# EasyEDA schematic SCH_OpenApolloV1.json
TITLE: OpenApollo CM5-powered Circuit; REV: 1.0; Date: 2025-07-07; Sheet: 1/1; Company: Your Company
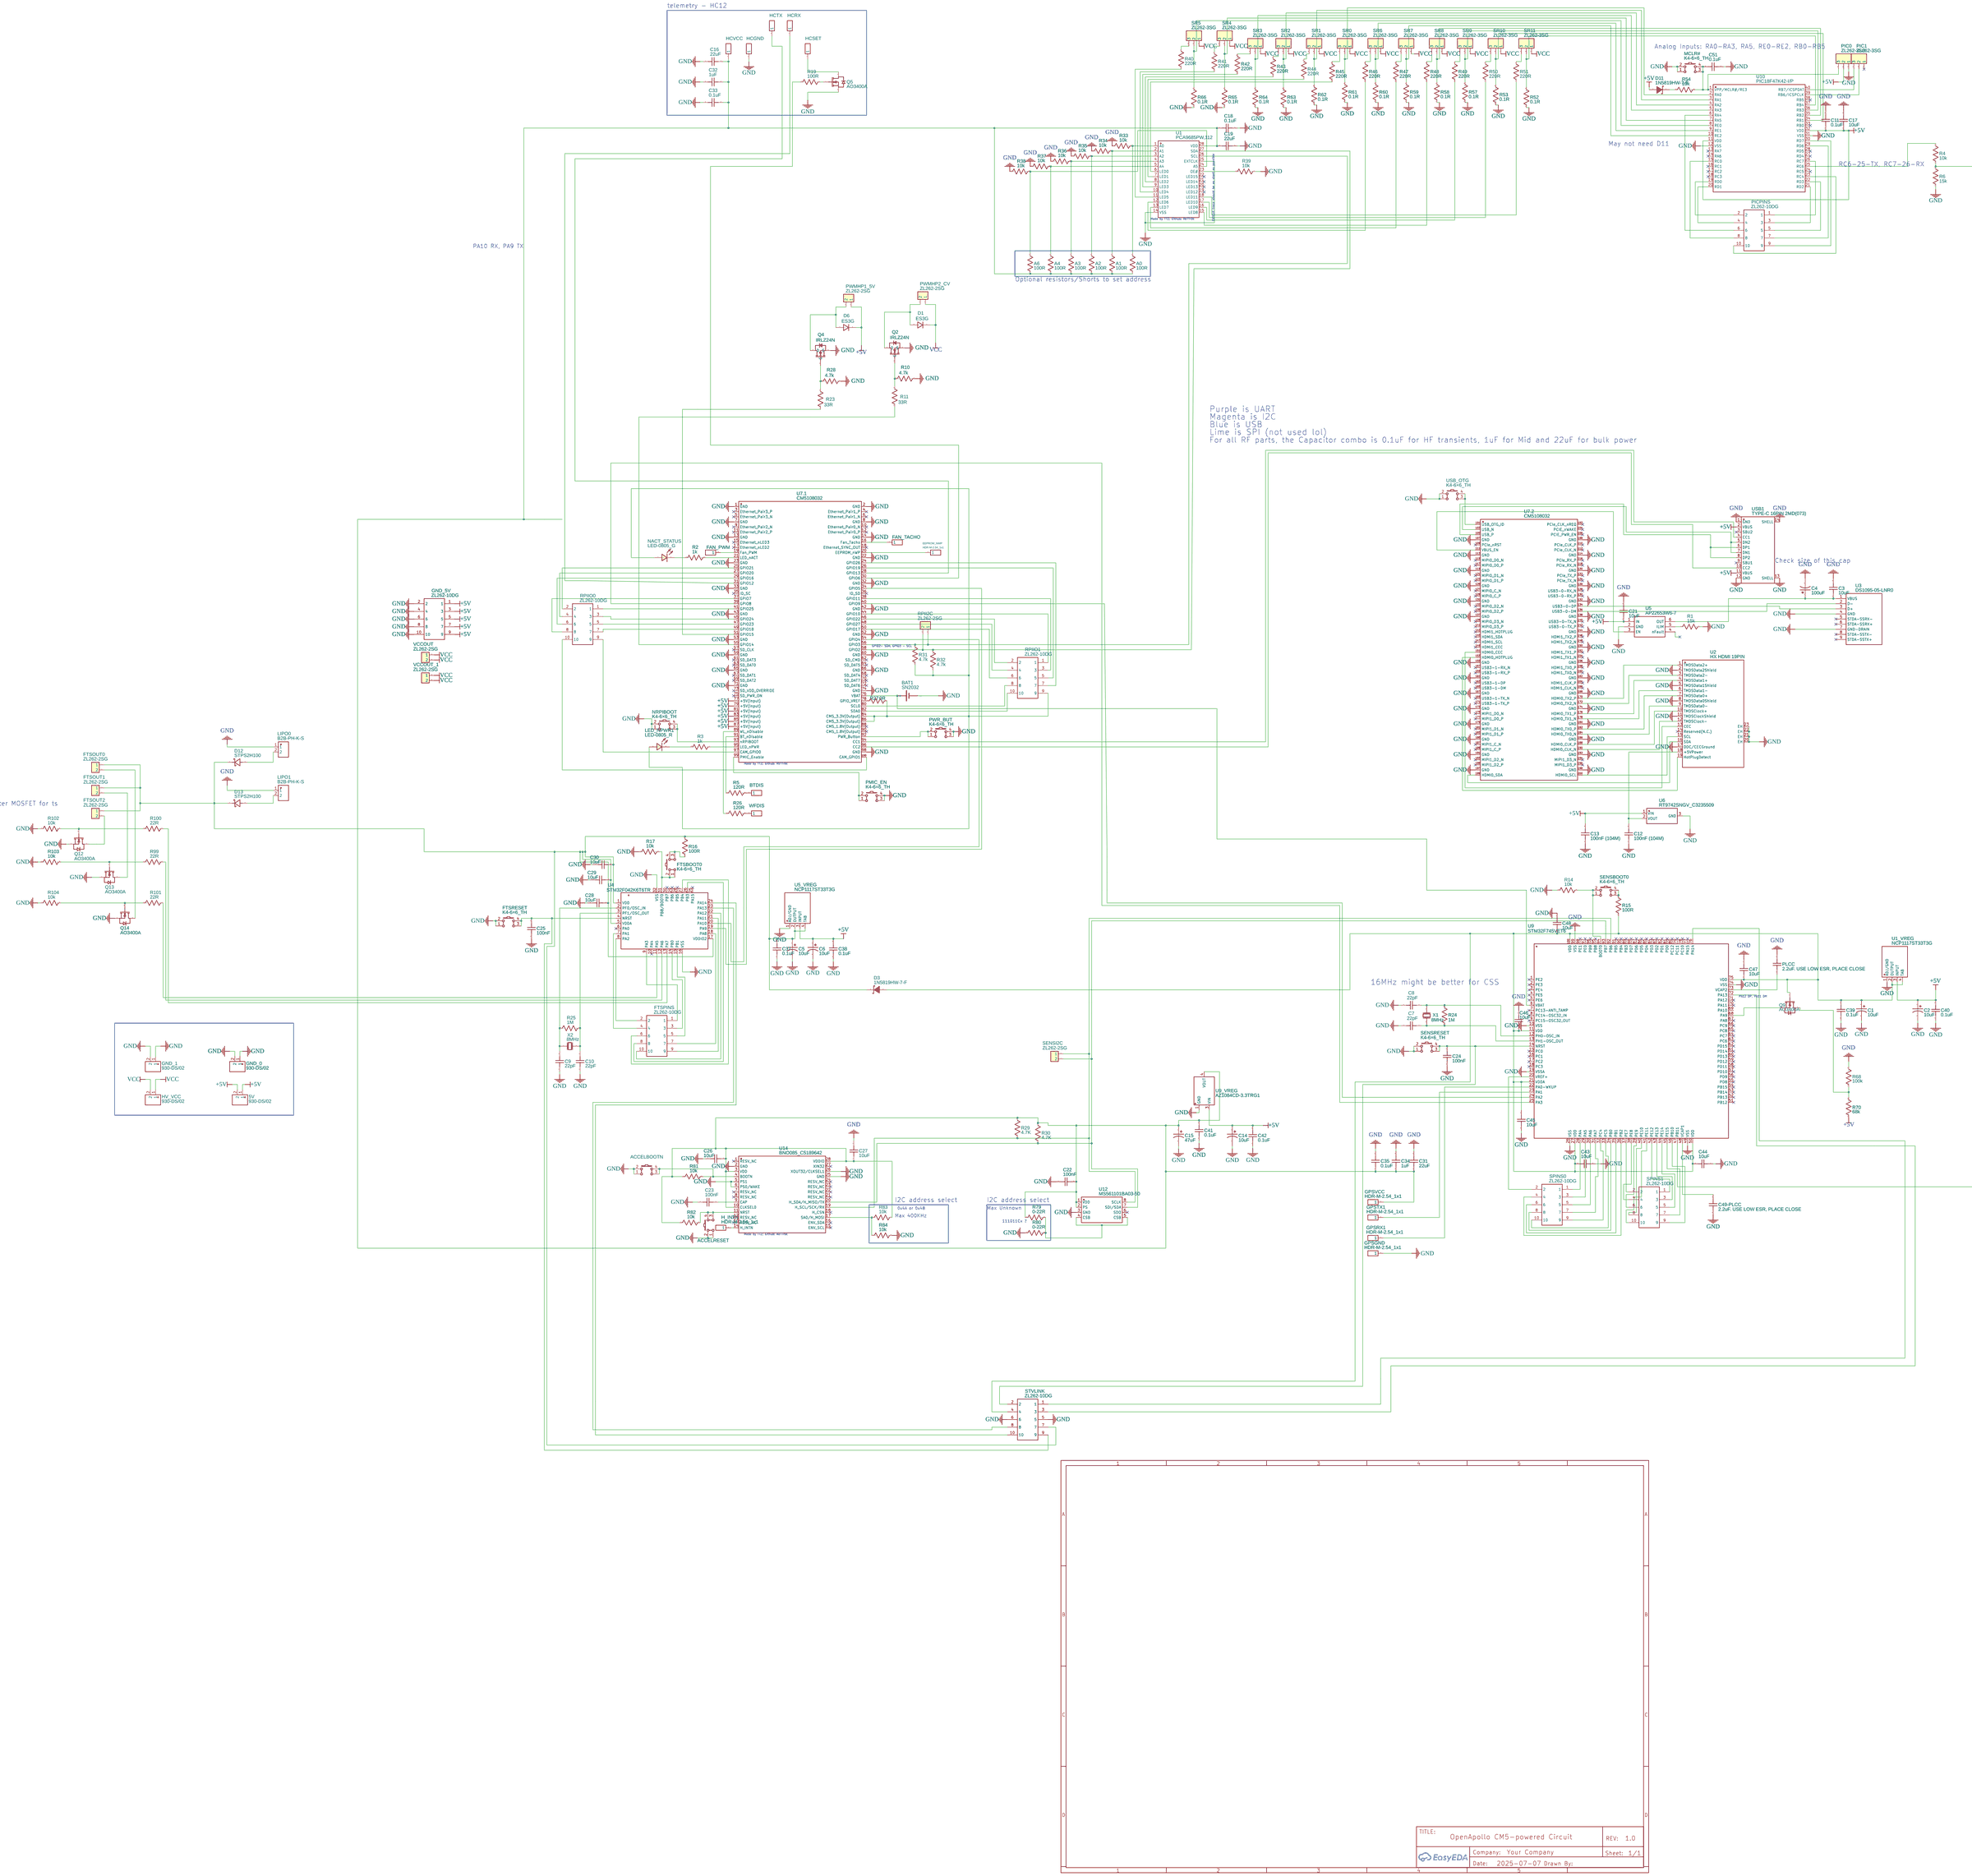
[diagram p0: schematic sheet]

## Parts
5V  930-DS/02  [CONN-TH_2P-P3.50_930-DS-02]
A0  100R  [R0805]
A1  100R  [R0805]
A2  100R  [R0805]
A3  100R  [R0805]
A4  100R  [R0805]
A6  100R  [R0805]
ACCELBOOTN  K4-6×6_TH  [KEY-TH_4P-L6.0-W6.0-P4.50-LS6.5]
ACCELRESET  K4-6×6_TH  [KEY-TH_4P-L6.0-W6.0-P4.50-LS6.5]
BAT1  SN2032  [SN2032]
BTDIS  HDR-M-2.54_1x1  [HDR-M-2.54_1X1]
C1  10uF  [CAP-D5.0×F2.0]
C2  10uF  [CAP-D5.0×F2.0]
C3  10uF  [C1206]
C4  100uF  [CAP-D6.3×F2.5]
C5  10uF  [CAP-D5.0×F2.0]
C6  10uF  [CAP-D5.0×F2.0]
C7  22pF  [RAD-0.1]
C8  22pF  [RAD-0.1]
C9  22pF  [RAD-0.1]
C10  22pF  [RAD-0.1]
C11  0.1uF  [C1206]
C12  100nF (104M)  [C1206]
C13  100nF (104M)  [C1206]
C14  10uF  [CAP-D5.0×F2.0]
C15  47uF  [CAP-D4.0×F1.5]
C16  22uF  [C1206]
C17  10uF  [C1206]
C18  0.1uF  [C1206]
C19  22uF  [C1206]
C21  10uF  [C1206]
C22  100nF  [C1206]
C23  100nF  [C1206]
C24  100nF  [C1206]
C25  100nF  [C1206]
C26  10uF  [C1206]
C27  10uF  [C1206]
C28  10uF  [C1206]
C29  10uF  [C1206]
C30  10uF  [C1206]
C31  22uF  [C1206]
C32  1uF  [C1206]
C33  0.1uF  [C1206]
C34  1uF  [C1206]
C35  0.1uF  [C1206]
C37  0.1uF  [C1206]
C38  0.1uF  [C1206]
C39  0.1uF  [C1206]
C40  0.1uF  [C1206]
C41  0.1uF  [C1206]
C42  0.1uF  [C1206]
C43  10uF  [C1206]
C44  10uF  [C1206]
C45  10uF  [C1206]
C46  10uF  [C1206]
C47  10uF  [C1206]
C48  10uF  [C1206]
C49-PLCC  2.2uF. USE LOW ESR, PLACE CLOSE  [C1206]
C51  0.1uF  [C1206]
D1  ES3G  [SMC_L7.1-W6.2-LS8.1-RD]
D3  1N5819HW-7-F  [SOD-123_L2.7-W1.6-LS3.7-RD]
D6  ES3G  [SMC_L7.1-W6.2-LS8.1-RD]
D11  1N5819HW-7-F  [SOD-123_L2.7-W1.6-LS3.7-RD]
D12  STPS2H100  [DO-41_BD2.4-L4.7-P8.70-D0.9-RD]
D13  STPS2H100  [DO-41_BD2.4-L4.7-P8.70-D0.9-RD]
EEPROM_NWP  HDR-M-2.54_1x1  [HDR-M-2.54_1X1]
FAN_PWM  HDR-M-2.54_1x1  [HDR-M-2.54_1X1]
FAN_TACHO  HDR-M-2.54_1x1  [HDR-M-2.54_1X1]
FTSBOOT0  K4-6×6_TH  [KEY-TH_4P-L6.0-W6.0-P4.50-LS6.5]
FTSOUT0  ZL262-2SG  [HEADER 1X2 FEMALE AG4]
FTSOUT1  ZL262-2SG  [HEADER 1X2 FEMALE AG4]
FTSOUT2  ZL262-2SG  [HEADER 1X2 FEMALE AG4]
FTSPINS  ZL262-10DG  [ZL262-10DG]
FTSRESET  K4-6×6_TH  [KEY-TH_4P-L6.0-W6.0-P4.50-LS6.5]
GND_0  930-DS/02  [CONN-TH_2P-P3.50_930-DS-02]
GND_1  930-DS/02  [CONN-TH_2P-P3.50_930-DS-02]
GND_5V  ZL262-10DG  [ZL262-10DG]
GPSGND  HDR-M-2.54_1x1  [HDR-M-2.54_1X1]
GPSRX1  HDR-M-2.54_1x1  [HDR-M-2.54_1X1]
GPSTX1  HDR-M-2.54_1x1  [HDR-M-2.54_1X1]
GPSVCC  HDR-M-2.54_1x1  [HDR-M-2.54_1X1]
H_INTN  HDR-M-2.54_1x1  [HDR-M-2.54_1X1]
HCGND  HDR-M-2.54_1x1  [HDR-M-2.54_1X1]
HCRX  HDR-M-2.54_1x1  [HDR-M-2.54_1X1]
HCSET  HDR-M-2.54_1x1  [HDR-M-2.54_1X1]
HCTX  HDR-M-2.54_1x1  [HDR-M-2.54_1X1]
HCVCC  HDR-M-2.54_1x1  [HDR-M-2.54_1X1]
HV_VCC  930-DS/02  [CONN-TH_2P-P3.50_930-DS-02]
LED_NPWR1  LED-0805_R  [LED0805_RED]
LIPO0  B2B-PH-K-S  [CONN-TH_B2B-PH-K-S]
LIPO1  B2B-PH-K-S  [CONN-TH_B2B-PH-K-S]
MCLR#  K4-6×6_TH  [KEY-TH_4P-L6.0-W6.0-P4.50-LS6.5]
NACT_STATUS  LED-0805_G  [LED0805_GREEN]
NRPIBOOT  K4-6×6_TH  [KEY-TH_4P-L6.0-W6.0-P4.50-LS6.5]
PIC0  ZL262-3SG  [HDR-F-2.54_1X3]
PIC1  ZL262-3SG  [HDR-F-2.54_1X3]
PICPINS  ZL262-10DG  [ZL262-10DG]
PLCC  2.2uF. USE LOW ESR, PLACE CLOSE  [C1206]
PMIC_EN  K4-6×6_TH  [KEY-TH_4P-L6.0-W6.0-P4.50-LS6.5]
PWMHP1_5V  ZL262-2SG  [HEADER 1X2 FEMALE AG4]
PWMHP2_CV  ZL262-2SG  [HEADER 1X2 FEMALE AG4]
PWR_BUT  K4-6×6_TH  [KEY-TH_4P-L6.0-W6.0-P4.50-LS6.5]
Q2  IRLZ24N  [IRLZ24N]
Q4  IRLZ24N  [IRLZ24N]
Q5  AO3400A  [SOT-23-3_L2.9-W1.3-P1.90-LS2.4-BR]
Q9  AO3400A  [SOT-23-3_L2.9-W1.3-P1.90-LS2.4-BR]
Q12  AO3400A  [SOT-23-3_L2.9-W1.3-P1.90-LS2.4-BR]
Q13  AO3400A  [SOT-23-3_L2.9-W1.3-P1.90-LS2.4-BR]
Q14  AO3400A  [SOT-23-3_L2.9-W1.3-P1.90-LS2.4-BR]
R1  15k  [R0805]
R2  1k  [R1206]
R3  1k  [R1206]
R4  10k  [R0805]
R5  120R  [R0805]
R6  15k  [R0805]
R10  4.7k  [R1206]
R11  33R  [R1206]
R14  10k  [R0805]
R15  100R  [R0805]
R16  100R  [R0805]
R17  10k  [R0805]
R19  100R  [R0805]
R23  33R  [R1206]
R24  1M  [R1206]
R25  1M  [R1206]
R26  120R  [R0805]
R27  0R  [R1206]
R28  4.7k  [R1206]
R29  4.7K  [R1206]
R30  4.7K  [R1206]
R31  4.7k  [R1206]
R32  4.7k  [R1206]
R33  10k  [R0805]
R34  10k  [R0805]
R35  10k  [R0805]
R36  10k  [R0805]
R37  10k  [R0805]
R38  10k  [R0805]
R39  10k  [R0805]
R40  220R  [R0805]
R41  220R  [R0805]
R42  220R  [R0805]
R43  220R  [R0805]
R44  220R  [R0805]
R45  220R  [R0805]
R46  220R  [R0805]
R47  220R  [R0805]
R48  220R  [R0805]
R49  220R  [R0805]
R50  220R  [R0805]
R51  220R  [R0805]
R52  0.1R  [R_AXIAL-0.8]
R53  0.1R  [R_AXIAL-0.8]
R54  10k  [R1206]
R57  0.1R  [R_AXIAL-0.8]
R58  0.1R  [R_AXIAL-0.8]
R59  0.1R  [R_AXIAL-0.8]
R60  0.1R  [R_AXIAL-0.8]
R61  0.1R  [R_AXIAL-0.8]
R62  0.1R  [R_AXIAL-0.8]
R63  0.1R  [R_AXIAL-0.8]
R64  0.1R  [R_AXIAL-0.8]
R65  0.1R  [R_AXIAL-0.8]
R66  0.1R  [R_AXIAL-0.8]
R68  100k  [R0805]
R70  68k  [R0805]
R79  0-22R  [R1206]
R80  0-22R  [R1206]
R81  10k  [R0805]
R82  10k  [R0805]
R83  10k  [R0805]
R84  10k  [R0805]
R99  22R  [R0805]
R100  22R  [R0805]
R101  22R  [R0805]
R102  10k  [R0805]
R103  10k  [R0805]
R104  10k  [R0805]
RPII2C  ZL262-2SG  [HEADER 1X2 FEMALE AG4]
RPIIO0  ZL262-10DG  [ZL262-10DG]
RPIIO1  ZL262-10DG  [ZL262-10DG]
SENSBOOT0  K4-6×6_TH  [KEY-TH_4P-L6.0-W6.0-P4.50-LS6.5]
SENSI2C  ZL262-2SG  [HEADER 1X2 FEMALE AG4]
SENSRESET  K4-6×6_TH  [KEY-TH_4P-L6.0-W6.0-P4.50-LS6.5]
SPINS0  ZL262-10DG  [ZL262-10DG]
SPINS1  ZL262-10DG  [ZL262-10DG]
SR0  ZL262-3SG  [HDR-F-2.54_1X3]
SR1  ZL262-3SG  [HDR-F-2.54_1X3]
SR2  ZL262-3SG  [HDR-F-2.54_1X3]
SR3  ZL262-3SG  [HDR-F-2.54_1X3]
SR4  ZL262-3SG  [HDR-F-2.54_1X3]
SR5  ZL262-3SG  [HDR-F-2.54_1X3]
SR6  ZL262-3SG  [HDR-F-2.54_1X3]
SR7  ZL262-3SG  [HDR-F-2.54_1X3]
SR8  ZL262-3SG  [HDR-F-2.54_1X3]
SR9  ZL262-3SG  [HDR-F-2.54_1X3]
SR10  ZL262-3SG  [HDR-F-2.54_1X3]
SR11  ZL262-3SG  [HDR-F-2.54_1X3]
STVLINK  ZL262-10DG  [ZL262-10DG]
U1  PCA9685PW,112  [TSSOP-28_L9.7-W4.4-P0.65-LS6.4-BL]
U1_VREG  NCP1117ST33T3G  [SOT-223-3_L6.5-W3.4-P2.30-LS7.0-BR]
U2  HX HDMI 19PIN  [HDMI-SMD_HX-HDMI-19PIN]
U3  DS1095-05-LNR0  [DS1095-05-LNR0]
U4  STM32F042K6T6TR  [LQFP-32_L7.0-W7.0-P0.80-LS9.0-BL]
U5  AP22653W6-7  [AP22653W6-7]
U5_VREG  NCP1117ST33T3G  [SOT-223-3_L6.5-W3.4-P2.30-LS7.0-BR]
U6  RT9742SNGV_C3235509  [SOT-23-3_L2.9-W1.6-P1.90-LS2.8-BR]
U7  CM5108032  [COMM-SMD_L55.0-W40.0_CM5]  (sections 1,2)
U9  STM32F745VET6  [LQFP-100_L14.0-W14.0-P0.50-LS16.0-BL]
U9_VREG  AZ1084CD-3.3TRG1  [TO-252-2_L6.5-W6.1-P4.58-LS10.0-TL]
U10  PIC18F47K42-I/P  [PDIP-40_L52.3-W13.8-P2.54-LS15.2-BL]
U12  MS561101BA03-50  [SENSORS-SMD_MS5611-01BA03]
U14  BNO085_C5189642  [LGA-28_L5.2-W3.8-P0.50-BL]
USB1  TYPE-C 16PIN 2MD(073)  [USB-C-SMD_TYPE-C-6PIN-2MD-073]
USB_OTG  K4-6×6_TH  [KEY-TH_4P-L6.0-W6.0-P4.50-LS6.5]
VCCOUT  ZL262-2SG  [HEADER 1X2 FEMALE AG4]
VCCOUT_1  ZL262-2SG  [HEADER 1X2 FEMALE AG4]
WFDIS  HDR-M-2.54_1x1  [HDR-M-2.54_1X1]
X1  8MHz  [HC-49S_L11.5-W4.7-P4.88]
X2  8MHz  [HC-49S_L11.5-W4.7-P4.88]

## Library data of the parts
5V GND_0 GND_1 HV_VCC = 930-DS/02: Supplier: LCSC; Supplier Part: C2974856; Manufacturer: WECO(威克德诺); Contributor: lcsc; JLCPCB Part Class: Extended Part
A0-A4 A6 R1 R4-R6 R14-R17 R19 R26 R33-R51 R68 R70 R81-R84 R99-R104 = R_0805_US: Contributor: LCEDA_Lib
ACCELBOOTN ACCELRESET FTSBOOT0 FTSRESET MCLR# NRPIBOOT PMIC_EN PWR_BUT SENSBOOT0 SENSRESET USB_OTG = K4-6×6_TH: Supplier: LCSC; Supplier Part: C136684; Manufacturer: 韩国韩荣; Manufacturer Part: K2-1102DP-E4SW-04; Contributor: LCEDA_Lib
BAT1 = SN2032: Contributor: lontecsac
BTDIS EEPROM_NWP FAN_PWM FAN_TACHO GPSGND GPSRX1 GPSTX1 GPSVCC H_INTN HCGND HCRX HCSET HCTX HCVCC WFDIS = HDR-M-2.54_1x1: Supplier Part: C81276; Supplier: LCSC; Contributor: LCEDA_Lib
C1 C2 C5 C6 C14 = CE_TH_D5.0×F2.0_US: Contributor: LCEDA_Lib
C3 C11-C13 C16-C19 C21-C35 C37-C48 C49-PLCC C51 PLCC = C_1206_US: Contributor: LCEDA_Lib
C4 = CE_TH_D6.3×F2.5_US: Contributor: LCEDA_Lib
C7-C10 = C_RAD-0.1_US: Contributor: LCEDA_Lib
C15 = CE_TH_D4.0×F1.5_US: Contributor: LCEDA_Lib
D1 D6 = ES3G-C: Contributor: AVR_NEL; Supplier Part: C163764; Supplier: LCSC; Manufacturer: FMS(美丽微); JLCPCB Part Class: Extended Part
D3 D11 = 1N5819HW-7-F: Supplier: LCSC; Manufacturer: DIODES(美台); Supplier Part: C82544; JLCPCB Part Class: Extended Part
D12 D13 = STPS2H100: Supplier: LCSC; Supplier Part: C2970310; Manufacturer: ST(意法半导体); JLCPCB Part Class: Extended Part; Contributor: lcsc
FTSOUT0-FTSOUT2 PWMHP1_5V PWMHP2_CV RPII2C SENSI2C VCCOUT VCCOUT_1 = ZL262-2SG: Contributor: AndrzejGeciow
FTSPINS GND_5V PICPINS RPIIO0 RPIIO1 SPINS0 SPINS1 STVLINK = ZL262-10DG: Contributor: marton_m
LED_NPWR1 = LED-0805_R: Manufacturer: EVERLIGHT(台湾亿光); Manufacturer Part: 17-21SURC/S530-A3/TR8; Supplier Part: C72037; Contributor: LCEDA_Lib
LIPO0 LIPO1 = B2B-PH-K-S: Supplier: LCSC; Supplier Part: C20504437; Manufacturer: JST; JLCPCB Part Class: Extended Part; Contributor: lcsc
NACT_STATUS = LED-0805_G: Manufacturer: 国星光电; Manufacturer Part: NCD0805G1; Supplier Part: C84260; Contributor: LCEDA_Lib
PIC0 PIC1 SR0-SR11 = ZL262-3SG: Manufacturer: CONNFLY; Supplier Part: 00-00040667; Supplier: Kosmodrom; link: http://www.kosmodrom.com.ua/prodlist.php?page=0&name=00-00040667&okbutton=Search; Contributor: AndrzejGeciow
Q2 Q4 = IRLZ24N: Supplier: LCSC; Manufacturer: IR; Manufacturer Part: IRLZ24n; Supplier Part: C11728; JLCPCB Part Class: Extended Part; Contributor: RuiMendes
Q5 Q9 Q12-Q14 = AO3400A: Supplier: LCSC; Manufacturer: AOS; Supplier Part: C20917; JLCPCB Part Class: Basic Part
R2 R3 R10 R11 R23-R25 R27-R32 R54 R79 R80 = R_1206_US: Contributor: LCEDA_Lib
R52 R53 R57-R66 = R_AXIAL-0.8_US: Contributor: LCEDA_Lib
U1 = PCA9685PW,112: Contributor: lcsc; Supplier: LCSC; Supplier Part: C2688894; Manufacturer: NXP(恩智浦); JLCPCB Part Class: Extended Part
U1_VREG U5_VREG = NCP1117ST33T3G: Supplier: LCSC; Manufacturer: onsemi(安森美); Supplier Part: C26537; JLCPCB Part Class: Extended Part
U2 = HX HDMI 19PIN: Contributor: lcsc; Supplier: LCSC; Supplier Part: C5184845; Manufacturer: hanxia(韩下); JLCPCB Part Class: Extended Part
U3 = DS1095-05-LNR0: Manufacturer: Connfly electronic (Zhenqin); Manufacturer Part: DS1095-05LNR0; Contributor: zyk83zyk
U4 = STM32F042K6T6TR: Contributor: LCSC; Supplier: LCSC; Supplier Part: C529323; Manufacturer: ST(意法半导体); JLCPCB Part Class: Extended Part
U5 = AP22653W6-7: Manufacturer: DIODES INC; Supplier Part: 31-AP22653W6-7TR-ND; Supplier: Digi-Key; link: https://www.diodes.com/assets/Datasheets/AP22652_53_52A_53A.pdf; Contributor: robertr2
U6 = RT9742SNGV_C3235509: Contributor: lcsc; Supplier: LCSC; Supplier Part: C3235509; Manufacturer: RICHTEK(立锜); Manufacturer Part: RT9742SNGV; JLCPCB Part Class: Extended Part
U7 = CM5108032: Supplier: Mouser; Supplier Part: C42394223; Manufacturer: Raspberry Pi(树莓派); subpart_no: 1
U9 = STM32F745VET6: Supplier: LCSC; Manufacturer: ST(意法半导体); Supplier Part: C87700; JLCPCB Part Class: Extended Part
U9_VREG = AZ1084CD-3.3TRG1: Contributor: LCSC; Supplier: LCSC; Supplier Part: C151391; Manufacturer: DIODES(美台); JLCPCB Part Class: Extended Part
U10 = PIC18F47K42-I/P: Contributor: LCSC; Supplier: LCSC; Supplier Part: C648048; Manufacturer: MICROCHIP(美国微芯); JLCPCB Part Class: Extended Part
U12 = MS561101BA03-50: Contributor: LCSC; Supplier: LCSC; Supplier Part: C15639; Manufacturer: TE Connectivity(泰科电子); JLCPCB Part Class: Extended Part
U14 = BNO085_C5189642: Supplier: LCSC; Supplier Part: C5189642; Manufacturer: CEVA; Manufacturer Part: BNO085; JLCPCB Part Class: Extended Part; Contributor: lcsc
USB1 = TYPE-C 16PIN 2MD(073): Contributor: LCSC; Supplier: LCSC; Supplier Part: C2765186; Manufacturer: SHOU HAN(首韩); JLCPCB Part Class: Extended Part
X1 X2 = 49SS-25.00-8-10-10/B: Supplier: LCSC; Supplier Part: C718637; Manufacturer: LIMING(利明); JLCPCB Part Class: Extended Part; Contributor: lcsc

## Nets
+5V: 5V.1 5V.2 C2.1 C6.1 C11.1 C13.2 C14.1 C17.1 C21.1 C38.2 C40.2 C42.2 D6.1 D11.2(A) GND_5V.1 GND_5V.3 GND_5V.5 GND_5V.7 GND_5V.9 PIC0.2 PWMHP1_5V.1 R70.1 U1_VREG.3(INPUT) U5.1(IN) U5_VREG.3(INPUT) U6.1(VIN) U7.77(+5V(Input)) U7.79(+5V(Input)) U7.81(+5V(Input)) U7.83(+5V(Input)) U7.85(+5V(Input)) U7.87(+5V(Input)) U9_VREG.3(VIN) U10.11(VDD) U10.32(VDD) USB1.2(VBUS) USB1.11(VBUS)
GND: ACCELBOOTN.1 ACCELBOOTN.2 ACCELRESET.1 ACCELRESET.2 BAT1.- C1.2 C2.2 C3.2 C4.2 C5.2 C6.2 C7.1 C8.1 C9.1 C10.1 C11.2 C12.1 C13.1 C14.2 C15.2 C16.1 C17.2 C18.2 C19.2 C21.2 C22.1 C23.1 C24.1 C25.1 C26.2 C27.2 C28.1 C29.1 C30.1 C31.2 C32.2 C33.2 C34.2 C35.2 C37.1 C38.1 C39.1 C40.1 C41.1 C42.1 C43.1 C44.1 C45.2 C46.2 C47.1 C48.1 C49-PLCC.2 C51.1 FTSRESET.1 FTSRESET.2 GND_0.1 GND_0.2 GND_1.1 GND_1.2 GND_5V.2 GND_5V.4 GND_5V.6 GND_5V.8 GND_5V.10 GPSGND.1 HCGND.1 LIPO0.1 LIPO1.1 MCLR#.1 MCLR#.2 NRPIBOOT.1 NRPIBOOT.2 PIC0.1 PLCC.1 PMIC_EN.3 PMIC_EN.4 PWR_BUT.3 PWR_BUT.4 Q2.3(S) Q4.3(S) Q5.2(S) Q12.2(S) Q13.2(S) Q14.2(S) R1.2 R6.1 R10.1 R14.1 R17.1 R28.1 R33.1 R34.1 R35.1 R36.1 R37.1 R38.1 R39.2 R52.1 R53.1 R57.1 R58.1 R59.1 R60.1 R61.1 R62.1 R63.1 R64.1 R65.1 R66.1 R68.2 R80.1 R84.2 R102.1 R103.1 R104.1 SENSRESET.1 SENSRESET.2 STVLINK.5 STVLINK.6 U1.14(VSS) U1.25(EXTCLK) U1_VREG.1(ADJ/GND) U2.2(TMDSData2Shield) U2.5(TMDSData1Shield) U2.8(TMDSData0Shield) U2.11(TMDSClockShield) U2.17(DDC/CECGround) U2.20(EH) U2.21(EH) U2.22(EH) U2.23(EH) U3.4(GND) U3.7(GND-DRAIN) U4.16(VSS) U4.32(VSS) U5.2(GND) U5_VREG.1(ADJ/GND) U6.3(GND) U7.1(GND) U7.2(GND) U7.7(GND) U7.8(GND) U7.13(GND) U7.14(GND) U7.22(GND) U7.23(GND) U7.32(GND) U7.33(GND) U7.42(GND) U7.43(GND) U7.52(GND) U7.53(GND) U7.59(GND) U7.60(GND) U7.65(GND) U7.66(GND) U7.71(GND) U7.74(GND) U7.98(GND) U7.107(GND) U7.108(GND) U7.113(GND) U7.114(GND) U7.119(GND) U7.120(GND) U7.125(GND) U7.126(GND) U7.131(GND) U7.132(GND) U7.137(GND) U7.138(GND) U7.144(GND) U7.150(GND) U7.155(GND) U7.156(GND) U7.161(GND) U7.162(GND) U7.167(GND) U7.168(GND) U7.173(GND) U7.174(GND) U7.179(GND) U7.180(GND) U7.185(GND) U7.186(GND) U7.191(GND) U7.192(GND) U7.197(GND) U7.198(GND) U9.10(VSS) U9.19(VSSA) U9.26(VSS) U9.49(VSS) U9.74(VSS) U9.99(VSS) U9_VREG.1(GND) U10.12(VSS) U10.31(VSS) U12.3(GND) U14.2(GND) U14.5(PS1) U14.6(PS0/WAKE) U14.25(GND) U14.26(XOUT32/CLKSEL1) USB1.1(GND) USB1.12(GND) USB1.13(SHELL) USB1.14(SHELL) USB_OTG.1 USB_OTG.2
VCC: D1.1 HV_VCC.1 HV_VCC.2 PWMHP2_CV.1 SR0.1 SR1.1 SR2.1 SR3.1 SR4.1 SR5.1 SR6.1 SR7.1 SR8.1 SR9.1 SR10.1 SR11.1 VCCOUT.1 VCCOUT.2 VCCOUT_1.1 VCCOUT_1.2
Net-(A0-1): A0.1 A1.1 A2.1 A3.1 A4.1 A6.1 C15.1 C16.2 C18.1 C19.1 C22.2 C26.1 C27.1 C31.1 C32.1 C33.1 C34.1 C35.1 C41.2 GPSVCC.1 HCVCC.1 R29.2 R30.2 R79.1 R81.1 R82.1 R83.2 U1.28(VDD) U9_VREG.4(VOUT) U12.1(VDD) U12.2(PS) U14.3(VDD) U14.10(CLKSEL0) U14.28(VDDIO)
Net-(A0-2): A0.2 R33.2 U1.1(A0)
Net-(A1-2): A1.2 R34.2 U1.2(A1)
Net-(A2-2): A2.2 R35.2 U1.3(A2)
Net-(A3-2): A3.2 R36.2 U1.4(A3)
Net-(A4-2): A4.2 R37.2 U1.5(A4)
Net-(A6-2): A6.2 R38.2 U1.24(A5)
Net-(ACCELBOOTN-3): ACCELBOOTN.3 ACCELBOOTN.4 R81.2 U14.4(BOOTN)
Net-(ACCELRESET-3): ACCELRESET.3 ACCELRESET.4 R82.2 U14.11(NRST)
Net-(BAT1-+): BAT1.+ U7.76(VBAT) U9.6(VBAT)
Net-(BTDIS-1): BTDIS.1 R5.2
Net-(C1-1): C1.1 C39.2 C43.2 C44.2 C45.1 C46.1 C47.2 C48.2 D3.2(A) Q9.1(G) R15.1 STVLINK.4 U1_VREG.2(OUTPUT) U1_VREG.4(TAB) U9.11(VDD) U9.21(VDDA) U9.27(VDD) U9.50(VDD) U9.75(VDD) U9.100(VDD)
Net-(C3-1): C3.1 C4.1 U3.1(VBUS) U5.6(OUT)
Net-(C5-1): C5.1 C28.2 C29.2 C30.2 C37.2 D3.1(K) D12.1(C) D13.1(C) FTSOUT0.1 FTSOUT1.1 FTSOUT2.1 R16.2 STVLINK.7 U4.1(VDD) U4.5(VDDA) U4.17(VDDIO2) U5_VREG.2(OUTPUT) U5_VREG.4(TAB)
Net-(C7-2): C7.2 R24.2 U9.13(PH1-OSC_OUT) X1.2
Net-(C8-2): C8.2 R24.1 U9.12(PH0-OSC_IN) X1.1
Net-(C9-2): C9.2 R25.1 U4.2(PF0/OSC_IN) X2.1
Net-(C10-2): C10.2 R25.2 U4.3(PF1/OSC_OUT) X2.2
Net-(C12-2): C12.2 U2.18(+5VPower) U6.2(VOUT)
Net-(C23-2): C23.2 U14.9(CAP)
Net-(C24-2): C24.2 SENSRESET.3 SENSRESET.4 STVLINK.2 U9.14(NRST)
Net-(C25-2): C25.2 FTSRESET.3 FTSRESET.4 STVLINK.9 U4.4(NRST)
Net-(C49-PLCC-1): C49-PLCC.1 U9.48(VCAP1)
Net-(C51-2): C51.2 MCLR#.3 MCLR#.4 PIC0.3 R54.2 U10.1(VPP/MCLR#/RE3)
Net-(D1-2): D1.2 PWMHP2_CV.2 Q2.2(D)
Net-(D6-2): D6.2 PWMHP1_5V.2 Q4.2(D)
Net-(D11-1): D11.1(K) R54.1
Net-(D12-2): D12.2(A) LIPO0.2
Net-(D13-2): D13.2(A) LIPO1.2
Net-(EEPROM_NWP-1): EEPROM_NWP.1 U7.20(EEPROM_nWP)
Net-(FAN_PWM-1): FAN_PWM.1 U7.19(Fan_PWM)
Net-(FAN_TACHO-1): FAN_TACHO.1 U7.16(Fan_Tacho)
Net-(FTSBOOT0-1): FTSBOOT0.1 FTSBOOT0.2 R17.2 U4.31(PB8/BOOT0)
Net-(FTSBOOT0-3): FTSBOOT0.3 FTSBOOT0.4 R16.1
Net-(FTSOUT0-2): FTSOUT0.2 Q14.3(D)
Net-(FTSOUT1-2): FTSOUT1.2 Q13.3(D)
Net-(FTSOUT2-2): FTSOUT2.2 Q12.3(D)
Net-(FTSPINS-1): FTSPINS.1 U4.9(PA3)
Net-(FTSPINS-2): FTSPINS.2 U4.8(PA2)
Net-(FTSPINS-3): FTSPINS.3 U4.14(PB0)
Net-(FTSPINS-4): FTSPINS.4 U4.7(PA1)
Net-(FTSPINS-5): FTSPINS.5 U4.15(PB1)
Net-(FTSPINS-6): FTSPINS.6 U4.27(PB4)
Net-(FTSPINS-7): FTSPINS.7 U4.18(PA8)
Net-(FTSPINS-8): FTSPINS.8 U4.26(PB3)
Net-(FTSPINS-9): FTSPINS.9 U4.21(PA11)
Net-(FTSPINS-10): FTSPINS.10 U4.22(PA12)
Net-(GPSRX1-1): GPSRX1.1 U9.22(PA0-WKUP)
Net-(GPSTX1-1): GPSTX1.1 U9.23(PA1)
Net-(H_INTN-1): H_INTN.1 U14.14(H_INTN)
Net-(HCRX-1): HCRX.1 U7.31(GPIO12)
Net-(HCSET-1): HCSET.1 Q5.3(D)
Net-(HCTX-1): HCTX.1 U7.28(GPIO13)
Net-(LED_NPWR1-1): LED_NPWR1.1 NACT_STATUS.1 R27.2 R31.1 R32.1 RPIIO1.9 U7.84(CM5_3.3V(Output)) U7.86(CM5_3.3V(Output))
Net-(LED_NPWR1-2): LED_NPWR1.2 R3.2
Net-(NACT_STATUS-2): NACT_STATUS.2 R2.2
Net-(NRPIBOOT-3): NRPIBOOT.3 NRPIBOOT.4 U7.93(nRPIBOOT)
Net-(PIC1-2): PIC1.2 U10.39(RB6/ICSPCLK)
Net-(PIC1-3): PIC1.3 U10.40(RB7/ICSPDAT)
Net-(PICPINS-1): PICPINS.1 U10.26(RC7)
Net-(PICPINS-2): PICPINS.2 U10.19(RD0)
Net-(PICPINS-3): PICPINS.3 U10.21(RD2)
Net-(PICPINS-4): PICPINS.4 U10.20(RD1)
Net-(PICPINS-5): PICPINS.5 U10.22(RD3)
Net-(PICPINS-6): PICPINS.6 U10.6(RA4)
Net-(PICPINS-7): PICPINS.7 U10.29(RD6)
Net-(PICPINS-8): PICPINS.8 U10.15(RC0)
Net-(PICPINS-9): PICPINS.9 U10.30(RD7)
Net-(PICPINS-10): PICPINS.10 U10.23(RC4)
Net-(PLCC-2): PLCC.2 U9.73(VCAP2)
Net-(PMIC_EN-1): PMIC_EN.1 PMIC_EN.2 U7.99(PMIC_Enable)
Net-(PWR_BUT-1): PWR_BUT.1 PWR_BUT.2 U7.92(PWR_Button)
Net-(Q2-1): Q2.1(G) R10.2 R11.2
Net-(Q4-1): Q4.1(G) R23.2 R28.2
Net-(Q5-1): Q5.1(G) R19.2
Net-(Q9-2): Q9.2(S) U9.68(PA9)
Net-(Q9-3): Q9.3(D) R68.1 R70.2
Net-(Q12-1): Q12.1(G) R100.2 R102.2
Net-(Q13-1): Q13.1(G) R99.1 R103.2
Net-(Q14-1): Q14.1(G) R101.2 R104.2
Net-(R1-1): R1.1 U5.5(ILIM)
Net-(R2-1): R2.1 U7.21(LED_nACT)
Net-(R3-1): R3.1 U7.95(LED_nPWR)
Net-(R4-1): R4.1 R6.2 U9.47(PB11)
Net-(R4-2): R4.2 U10.25(RC6)
Net-(R5-1): R5.1 U7.91(BT_nDisable)
Net-(R11-1): R11.1 U7.55(GPIO14)
Net-(R14-2): R14.2 SENSBOOT0.1 SENSBOOT0.2 U9.94(BOOT0)
Net-(R15-2): R15.2 SENSBOOT0.3 SENSBOOT0.4
Net-(R19-1): R19.1 U7.30(GPIO6)
Net-(R23-1): R23.1 U7.51(GPIO15)
Net-(R26-1): R26.1 U7.89(WL_nDisable)
Net-(R26-2): R26.2 WFDIS.1
Net-(R27-1): R27.1 U7.78(GPIO_VREF)
Net-(R29-1): R29.1 SENSI2C.1 U9.92(PB6) U12.8(SCLK) U14.19(H_SCL/SCK/RX)
Net-(R30-1): R30.1 SENSI2C.2 U9.93(PB7) U12.7(SDI/SDA) U14.20(H_SDA/H_MISO/TX)
Net-(R31-2): R31.2 RPII2C.1 U1.26(SCL) U7.56(GPIO3)
Net-(R32-2): R32.2 RPII2C.2 U1.27(SDA) U7.58(GPIO2)
Net-(R39-1): R39.1 U1.23(OE#)
Net-(R40-1): R40.1 U1.11(LED5)
Net-(R40-2): R40.2 SR5.3
Net-(R41-1): R41.1 U1.10(LED4)
Net-(R41-2): R41.2 SR4.3
Net-(R42-1): R42.1 U1.9(LED3)
Net-(R42-2): R42.2 SR3.3
Net-(R43-1): R43.1 U1.8(LED2)
Net-(R43-2): R43.2 SR2.3
Net-(R44-1): R44.1 U1.7(LED1)
Net-(R44-2): R44.2 SR1.3
Net-(R45-1): R45.1 U1.6(LED0)
Net-(R45-2): R45.2 SR0.3
Net-(R46-1): R46.1 U1.12(LED6)
Net-(R46-2): R46.2 SR6.3
Net-(R47-1): R47.1 U1.13(LED7)
Net-(R47-2): R47.2 SR7.3
Net-(R48-1): R48.1 U1.15(LED8)
Net-(R48-2): R48.2 SR8.3
Net-(R49-1): R49.1 U1.16(LED9)
Net-(R49-2): R49.2 SR9.3
Net-(R50-1): R50.1 U1.17(LED10)
Net-(R50-2): R50.2 SR10.3
Net-(R51-1): R51.1 U1.18(LED11)
Net-(R51-2): R51.2 SR11.3
Net-(R52-2): R52.2 SR11.2 U10.37(RB4)
Net-(R53-2): R53.2 SR10.2 U10.34(RB1)
Net-(R57-2): R57.2 SR9.2 U10.36(RB3)
Net-(R58-2): R58.2 SR8.2 U10.35(RB2)
Net-(R59-2): R59.2 SR7.2 U10.10(RE2)
Net-(R60-2): R60.2 SR6.2 U10.9(RE1)
Net-(R61-2): R61.2 SR0.2 U10.2(RA0)
Net-(R62-2): R62.2 SR1.2 U10.3(RA1)
Net-(R63-2): R63.2 SR2.2 U10.4(RA2)
Net-(R64-2): R64.2 SR3.2 U10.5(RA3)
Net-(R65-2): R65.2 SR4.2 U10.7(RA5)
Net-(R66-2): R66.2 SR5.2 U10.8(RE0)
Net-(R79-2): R79.2 R80.2 U12.4(CSB) U12.5(CSB)
Net-(R83-1): R83.1 R84.1 U14.17(SA0/H_MOSI)
Net-(R99-2): R99.2 U4.12(PA6)
Net-(R100-1): R100.1 U4.13(PA7)
Net-(R101-1): R101.1 U4.11(PA5)
Net-(RPIIO0-1): RPIIO0.1 U7.41(GPIO25)
Net-(RPIIO0-2): RPIIO0.2 U7.25(GPIO21)
Net-(RPIIO0-3): RPIIO0.3 U7.45(GPIO24)
Net-(RPIIO0-4): RPIIO0.4 U7.27(GPIO20)
Net-(RPIIO0-5): RPIIO0.5 U7.47(GPIO23)
Net-(RPIIO0-6): RPIIO0.6 U7.29(GPIO16)
Net-(RPIIO0-7): RPIIO0.7 U7.49(GPIO18)
Net-(RPIIO0-8): RPIIO0.8 U7.37(GPIO7)
Net-(RPIIO0-9): RPIIO0.9 U7.97(CAM_GPIO0)
Net-(RPIIO0-10): RPIIO0.10 U7.100(CAM_GPIO1)
Net-(RPIIO1-1): RPIIO1.1 U7.44(GPIO10)
Net-(RPIIO1-2): RPIIO1.2 U7.46(GPIO22)
Net-(RPIIO1-3): RPIIO1.3 U7.38(GPIO11)
Net-(RPIIO1-4): RPIIO1.4 U7.48(GPIO27)
Net-(RPIIO1-5): RPIIO1.5 U7.26(GPIO19)
Net-(RPIIO1-6): RPIIO1.6 U7.50(GPIO17)
Net-(RPIIO1-7): RPIIO1.7 U7.24(GPIO26)
Net-(RPIIO1-8): RPIIO1.8 U7.80(SCL0)
Net-(RPIIO1-10): RPIIO1.10 U7.82(SDA0)
Net-(SPINS0-1): SPINS0.1 U9.28(PA4)
Net-(SPINS0-2): SPINS0.2 U9.20(VREF+)
Net-(SPINS0-3): SPINS0.3 U9.29(PA5)
Net-(SPINS0-4): SPINS0.4 U9.36(PB2)
Net-(SPINS0-5): SPINS0.5 U9.30(PA6)
Net-(SPINS0-6): SPINS0.6 U9.35(PB1)
Net-(SPINS0-7): SPINS0.7 U9.31(PA7)
Net-(SPINS0-8): SPINS0.8 U9.34(PB0)
Net-(SPINS0-9): SPINS0.9 U9.32(PC4)
Net-(SPINS0-10): SPINS0.10 U9.33(PC5)
Net-(SPINS1-1): SPINS1.1 U9.42(PE12)
Net-(SPINS1-2): SPINS1.2 U9.37(PE7)
Net-(SPINS1-3): SPINS1.3 U9.43(PE13)
Net-(SPINS1-4): SPINS1.4 U9.38(PE8)
Net-(SPINS1-5): SPINS1.5 U9.44(PE14)
Net-(SPINS1-6): SPINS1.6 U9.39(PE9)
Net-(SPINS1-7): SPINS1.7 U9.45(PE15)
Net-(SPINS1-8): SPINS1.8 U9.40(PE10)
Net-(SPINS1-9): SPINS1.9 U9.46(PB10)
Net-(SPINS1-10): SPINS1.10 U9.41(PE11)
Net-(STVLINK-1): STVLINK.1 U9.76(PA14)
Net-(STVLINK-3): STVLINK.3 U9.72(PA13)
Net-(STVLINK-8): STVLINK.8 U4.23(PA13)
Net-(STVLINK-10): STVLINK.10 U4.24(PA14)
Net-(U2-1): U2.1(TMDSData2+) U7.170(HDMI0_TX2_P)
Net-(U2-3): U2.3(TMDSData2-) U7.172(HDMI0_TX2_N)
Net-(U2-4): U2.4(TMDSData1+) U7.176(HDMI0_TX1_P)
Net-(U2-6): U2.6(TMDSData1-) U7.178(HDMI0_TX1_N)
Net-(U2-7): U2.7(TMDSData0+) U7.182(HDMI0_TX0_P)
Net-(U2-9): U2.9(TMDSData0-) U7.184(HDMI0_TX0_N)
Net-(U2-10): U2.10(TMDSClock+) U7.188(HDMI0_CLK_P)
Net-(U2-12): U2.12(TMDSClock-) U7.190(HDMI0_CLK_N)
Net-(U2-13): U2.13(CEC) U7.151(HDMI0_CEC)
Net-(U2-15): U2.15(SCL) U7.200(HDMI0_SCL)
Net-(U2-16): U2.16(SDA) U7.199(HDMI0_SDA)
Net-(U2-19): U2.19(HotPlugDetect) U7.153(HDMI0_HOTPLUG)
Net-(U3-2): U3.2(D-) U7.136(USB3-0-DM)
Net-(U3-3): U3.3(D+) U7.134(USB3-0-DP)
Net-(U4-19): U4.19(PA9) U7.34(GPIO5)
Net-(U4-20): U4.20(PA10) U7.54(GPIO4)
Net-(U5-3): U5.3(EN) U7.111(VBUS_EN)
Net-(U7.1-39): U7.39(GPIO8) U9.25(PA3)
Net-(U7.1-40): U7.40(GPIO9) U9.24(PA2)
Net-(U7.1-94): U7.94(CC1) USB1.4(CC1)
Net-(U7.1-96): U7.96(CC2) USB1.10(CC2)
Net-(U7.2-101): U7.101(USB_OTG_ID) USB_OTG.3 USB_OTG.4
Net-(U7.2-103): U7.103(USB_N) USB1.5(DN2) USB1.7(DN1)
Net-(U7.2-105): U7.105(USB_P) USB1.6(DP1) USB1.8(DP2)

Not connected (* = marked no-connect by the designer): PIC1 1*; U1 19(LED12)* 20(LED13)* 21(LED14)* 22(LED15)*; U2 14(Reserved(N.C.))*; U3 5(STDA-SSRX-)* 6(STDA-SSRX+)* 8(STDA-SSTX-)* 9(STDA-SSTX+)*; U4 6(PA0)* 10(PA4)* 25(PA15)* 28(PB5)* 29(PB6)* 30(PB7)*; U5 4(nFault); U7 3(Ethernet_Pair3_P)* 4(Ethernet_Pair1_P)* 5(Ethernet_Pair3_N)* 6(Ethernet_Pair1_N)* 9(Ethernet_Pair2_N)* 10(Ethernet_Pair0_N)* 11(Ethernet_Pair2_P)* 12(Ethernet_Pair0_P)* 15(Ethernet_nLED3)* 17(Ethernet_nLED2)* 18(Ethernet_SYNC_OUT)* 35(ID_SC)* 36(ID_SD)* 57(SD_CLK)* 61(SD_DAT3)* 62(SD_CMD)* 63(SD_DAT0)* 64(SD_DAT5)* 67(SD_DAT1)* 68(SD_DAT4)* 69(SD_DAT2)* 70(SD_DAT7)* 72(SD_DAT6)* 73(SD_VDD_OVERRIDE)* 75(SD_PWR_ON)* 88(CM5_1.8V(Output))* 90(CM5_1.8V(Output))* 102(PCIe_CLK_nREQ)* 104(PCIE_nWAKE)* 106(PCIE_PWR_EN)* 109(PCIe_nRST)* 110(PCIe_CLK_P)* 112(PCIe_CLK_N)* 115(MIPI0_D0_N)* 116(PCIe_RX_P)* 117(MIPI0_D0_P)* 118(PCIe_RX_N)* 121(MIPI0_D1_N)* 122(PCIe_TX_P)* 123(MIPI0_D1_P)* 124(PCIe_TX_N)* 127(MIPI0_C_N)* 128(USB3-0-RX_N)* 129(MIPI0_C_P)* 130(USB3-0-RX_P)* 133(MIPI0_D2_N)* 135(MIPI0_D2_P)* 139(MIPI0_D3_N)* 140(USB3-0-TX_N)* 141(MIPI0_D3_P)* 142(USB3-0-TX_P)* 143(HDMI1_HOTPLUG)* 145(HDMI1_SDA)* 146(HDMI1_TX2_P)* 147(HDMI1_SCL)* 148(HDMI1_TX2_N)* 149(HDMI1_CEC)* 152(HDMI1_TX1_P)* 154(HDMI1_TX1_N)* 157(USB3-1-RX_N)* 158(HDMI1_TX0_P)* 159(USB3-1-RX_P)* 160(HDMI1_TX0_N)* 163(USB3-1-DP)* 164(HDMI1_CLK_P)* 165(USB3-1-DM)* 166(HDMI1_CLK_N)* 169(USB3-1-TX_N)* 171(USB3-1-TX_P)* 175(MIPI1_D0_N)* 177(MIPI1_D0_P)* 181(MIPI1_D1_N)* 183(MIPI1_D1_P)* 187(MIPI1_C_N)* 189(MIPI1_C_P)* 193(MIPI1_D2_N)* 194(MIPI1_D3_N)* 195(MIPI1_D2_P)* 196(MIPI1_D3_P)*; U9 1(PE2)* 2(PE3)* 3(PE4)* 4(PE5)* 5(PE6)* 7(PC13-ANTI_TAMP)* 8(PC14-OSC32_IN)* 9(PC15-OSC32_OUT)* 15(PC0)* 16(PC1)* 17(PC2)* 18(PC3)* 51(PB12)* 52(PB13)* 53(PB14)* 54(PB15)* 55(PD8)* 56(PD9)* 57(PD10)* 58(PD11)* 59(PD12)* 60(PD13)* 61(PD14)* 62(PD15)* 63(PC6)* 64(PC7)* 65(PC8)* 66(PC9)* 67(PA8)* 69(PA10) 70(PA11)* 71(PA12)* 77(PA15)* 78(PC10)* 79(PC11)* 80(PC12)* 81(PD0)* 82(PD1)* 83(PD2)* 84(PD3)* 85(PD4)* 86(PD5)* 87(PD6)* 88(PD7)* 89(PB3)* 90(PB4)* 91(PB5)* 95(PB8)* 96(PB9)* 97(PE0)* 98(PE1)*; U10 13(RA7)* 14(RA6)* 16(RC1)* 17(RC2)* 18(RC3)* 24(RC5)* 27(RD4)* 28(RD5)* 33(RB0)* 38(RB5)*; U12 6(SDO)*; U14 1(RESV_NC)* 7(RESV_NC)* 8(RESV_NC)* 12(RESV_NC)* 13(RESV_NC)* 15(ENV_SCL)* 16(ENV_SDA)* 18(H_CSN)* 21(RESV_NC)* 22(RESV_NC)* 23(RESV_NC)* 24(RESV_NC)* 27(XIN32)*; USB1 3(SBU2)* 9(SBU1)*

## Notes on the sheet
- Consider connecting #OE to an FTS pin. If #OE goes high, it shuts down servos
- telemetry - HC12
- Analog Inputs: RA0-RA3, RA5, RE0-RE2, RB0-RB5
- May not need D11
- RC6-25-TX, RC7-26-RX
- Made by TTZ; Github: ReTTr0c
- EXTCLK trace should be as short as possible
- PA10 RX, PA9 TX
- Optional resistors/Shorts to set address
- Purple is UART
- Magenta is I2C
- Blue is USB
- Lime is SPI (not used lol)
- For all RF parts, the Capacitor combo is 0.1uF for HF transients, 1uF for Mid and 22uF for bulk power
- Check size of this cap
- GPIO2- SDA; GPIO3 - SCL
- Made by TTZ; Github: ReTTr0c
- Find better MOSFET for ts
- 16MHz might be better for CSS
- PA12 DP, PA11 DM
- I2C address select
- I2C address select
- 0x4A or 0x4B
- Max Unknown
- Max 400KHz
- 111011Cx ?
- Made by TTZ; Github: ReTTr0c
